# EAGLE design flossjtag (EAGLE 7.4.0)
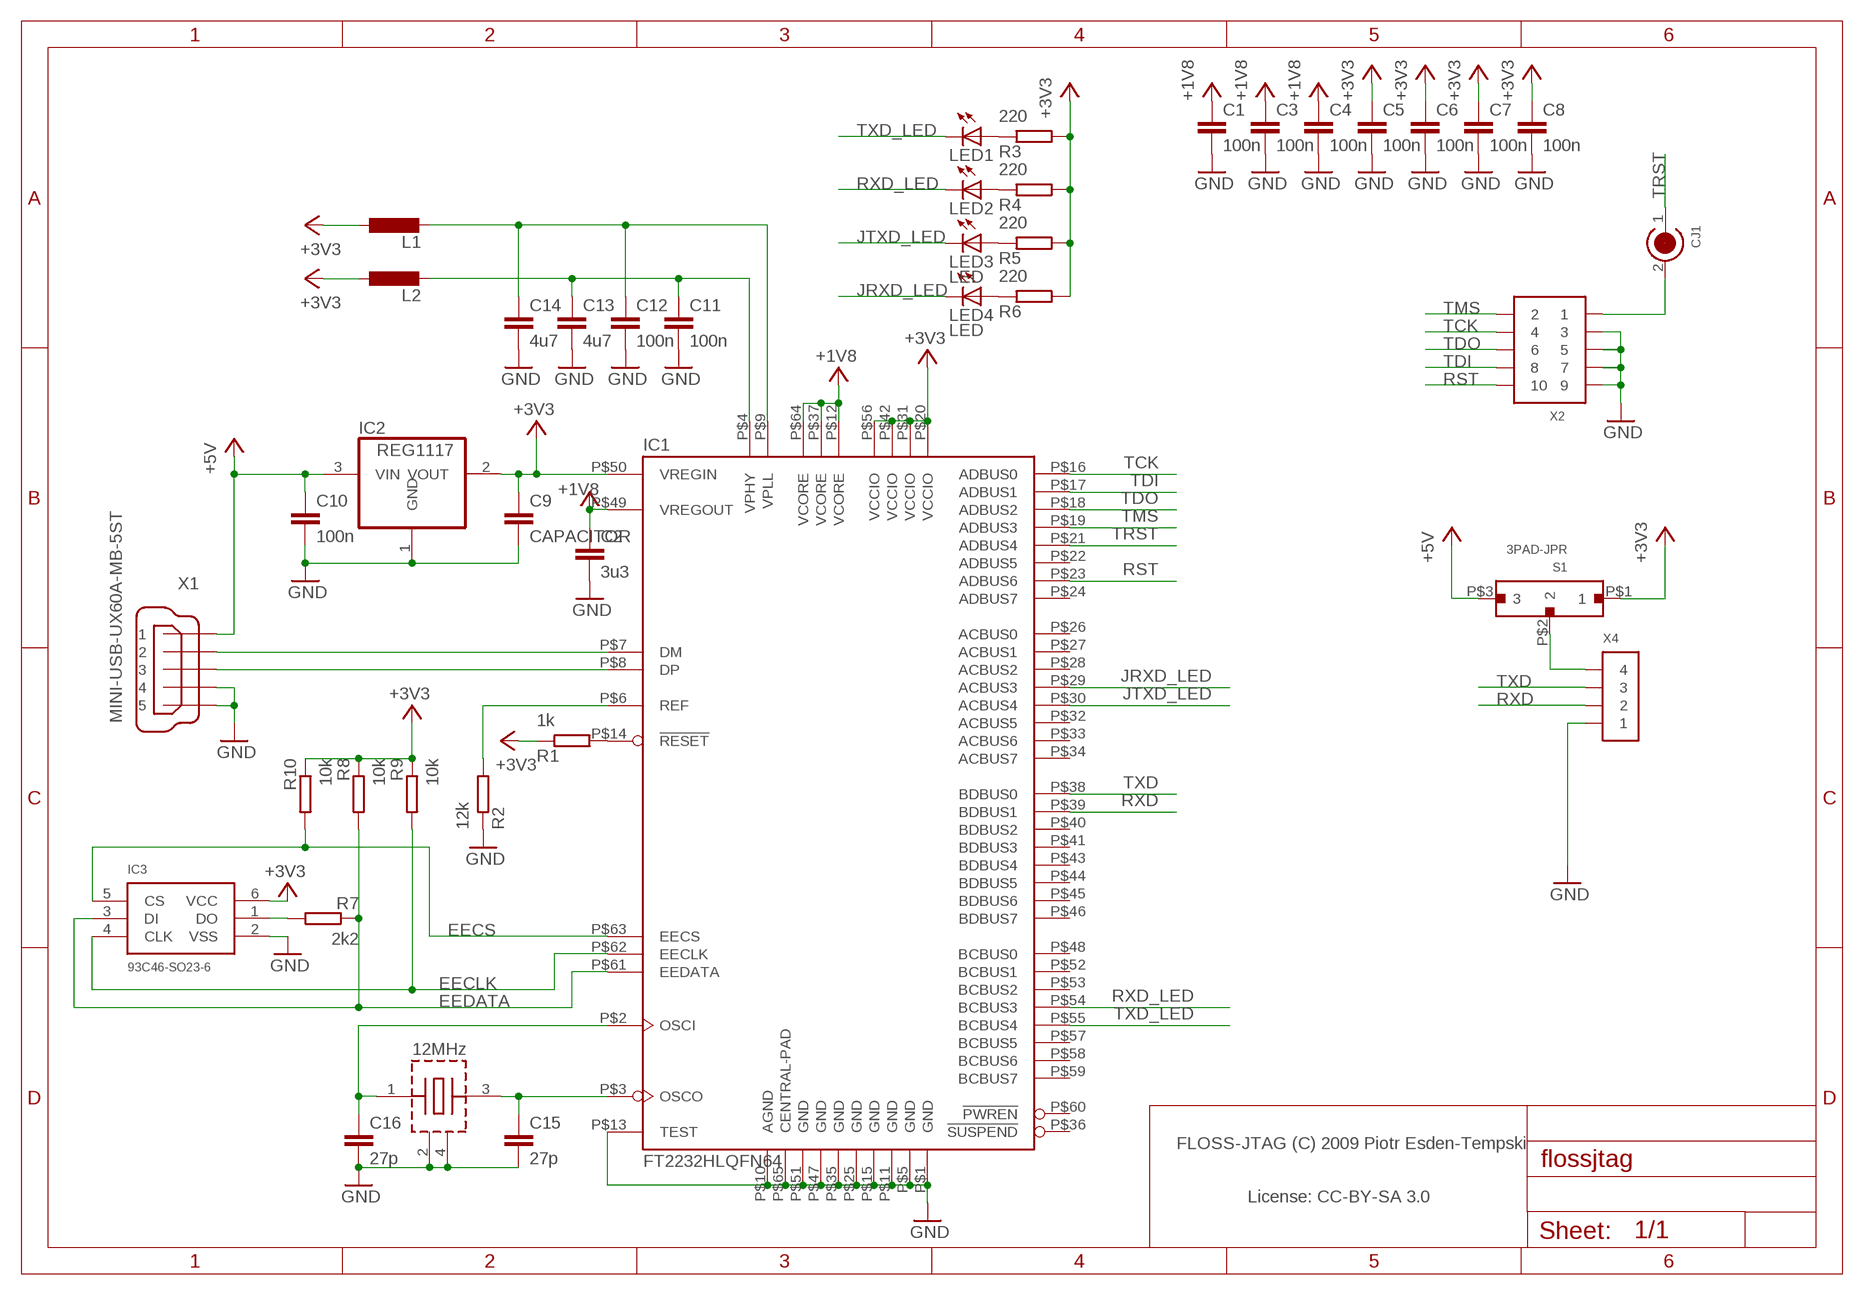
[diagram p0: schematic, sheet 1]

## Parts
C1  100n  CAPACITOR-0603  [0603-CAP]
C2  3u3  CAPACITOR-0603  [0603-CAP]
C3  100n  CAPACITOR-0603  [0603-CAP]
C4  100n  CAPACITOR-0603  [0603-CAP]
C5  100n  CAPACITOR-0603  [0603-CAP]
C6  100n  CAPACITOR-0603  [0603-CAP]
C7  100n  CAPACITOR-0603  [0603-CAP]
C8  100n  CAPACITOR-0603  [0603-CAP]
C9  CAPACITOR  [0603-CAP]
C10  100n  CAPACITOR  [0603-CAP]
C11  100n  CAPACITOR-0603  [0603-CAP]
C12  100n  CAPACITOR-0603  [0603-CAP]
C13  4u7  CAPACITOR-0603  [0603-CAP]
C14  4u7  CAPACITOR-0603  [0603-CAP]
C15  27p  CAPACITOR  [0603-CAP]
C16  27p  CAPACITOR  [0603-CAP]
CJ1  CIRC_JMP  [CIRC_JMP]
IC1  FT2232HLQFN64  [QFN64]
IC2  REG1117  [SOT223]
IC3  93C46-SO23-6  [SO23-6]
L1  INDUCTOR-0603  [0603-IND]
L2  INDUCTOR-0603  [0603-IND]
LED1  LED  [0603-LED]
LED2  LED  [0603-LED]
LED3  LED  [0603-LED]
LED4  LED  [0603-LED]
R1  1k  RESISTOR-0603  [0603-RES]
R2  12k  RESISTOR-0603  [0603-RES]
R3  220  RESISTOR-0603  [0603-RES]
R4  220  RESISTOR-0603  [0603-RES]
R5  220  RESISTOR-0603  [0603-RES]
R6  220  RESISTOR-0603  [0603-RES]
R7  2k2  RESISTOR-0603  [0603-RES]
R8  10k  RESISTOR-0603  [0603-RES]
R9  10k  RESISTOR-0603  [0603-RES]
R10  10k  RESISTOR-0603  [0603-RES]
S1  3PAD-JPR  [SW-JS102000SAQN]
X1  MINI-USB-UX60A-MB-5ST  [UX60A-MB-5ST]
X2  CONN_5-2-FTSH-V  [FTSH-105-DV]
X3  12MHz  NX3225SA  [NX3225SA]
X4  CONN_4-1  [PB-53261-04]

## Nets
+3V3: C5.P$1 C6.P$1 C7.P$1 C8.P$1 C9.P$1 IC1.P$20(VCCIO) IC1.P$31(VCCIO) IC1.P$42(VCCIO) IC1.P$50(VREGIN) IC1.P$56(VCCIO) IC2.2(VOUT) IC3.6(VCC) L1.P$1 L2.P$1 R1.P$1 R3.P$2 R4.P$2 R5.P$2 R6.P$2 R8.P$1 R9.P$1 R10.P$1 S1.P$1
+5V: C10.P$1 IC2.3(VIN) S1.P$3 X1.1
EECLK: IC1.P$62(EECLK) IC3.4(CLK) R9.P$2
EECS: IC1.P$63(EECS) IC3.5(CS) R10.P$2
EEDATA: IC1.P$61(EEDATA) IC3.3(DI) R7.P$1 R8.P$2
GND: C1.P$2 C2.P$2 C3.P$2 C4.P$2 C5.P$2 C6.P$2 C7.P$2 C8.P$2 C9.P$2 C10.P$2 C11.P$2 C12.P$2 C13.P$2 C14.P$2 C15.P$2 C16.P$2 IC1.P$1(GND) IC1.P$5(GND) IC1.P$10(AGND) IC1.P$11(GND) IC1.P$13(TEST) IC1.P$15(GND) IC1.P$25(GND) IC1.P$35(GND) IC1.P$47(GND) IC1.P$51(GND) IC1.P$65(CENTRAL-PAD) IC2.1(GND) IC3.2(VSS) R2.P$1 X1.4 X1.5 X2.3 X2.5 X2.7 X2.9 X3.2(GND) X3.4(GND) X4.1
JRXD_LED: IC1.P$29(ACBUS3) LED4.C
JTXD_LED: IC1.P$30(ACBUS4) LED3.C
N$1: IC1.P$14(!RESET) R1.P$2
N$2: IC1.P$6(REF) R2.P$2
N$3: IC1.P$7(DM) X1.2
N$4: IC1.P$8(DP) X1.3
N$6: C16.P$1 IC1.P$2(OSCI) X3.1(XTAL)
N$7: C12.P$1 C14.P$1 IC1.P$9(VPLL) L1.P$2
N$8: C11.P$1 C13.P$1 IC1.P$4(VPHY) L2.P$2
N$9: C15.P$1 IC1.P$3(OSCO) X3.3(XTAL)
N$10: LED1.A R3.P$1
N$11: LED2.A R4.P$1
N$12: LED3.A R5.P$1
N$13: LED4.A R6.P$1
N$14: S1.P$2 X4.4
N$17: IC3.1(DO) R7.P$2
N$19: CJ1.2 X2.1
RST: IC1.P$23(ADBUS6) X2.10
RXD: IC1.P$39(BDBUS1) X4.2
RXD_LED: IC1.P$54(BCBUS3) LED2.C
TCK: IC1.P$16(ADBUS0) X2.4
TDI: IC1.P$17(ADBUS1) X2.8
TDO: IC1.P$18(ADBUS2) X2.6
TMS: IC1.P$19(ADBUS3) X2.2
TRST: CJ1.1 IC1.P$21(ADBUS4)
TXD: IC1.P$38(BDBUS0) X4.3
TXD_LED: IC1.P$55(BCBUS4) LED1.C
VCC: C1.P$1 C2.P$1 C3.P$1 C4.P$1 IC1.P$12(VCORE) IC1.P$37(VCORE) IC1.P$49(VREGOUT) IC1.P$64(VCORE) ; supply symbol labelled +1V8
Unconnected: IC1.P$22(ADBUS5) IC1.P$24(ADBUS7) IC1.P$26(ACBUS0) IC1.P$27(ACBUS1) IC1.P$28(ACBUS2) IC1.P$32(ACBUS5) IC1.P$33(ACBUS6) IC1.P$34(ACBUS7) IC1.P$36(!SUSPEND) IC1.P$40(BDBUS2) IC1.P$41(BDBUS3) IC1.P$43(BDBUS4) IC1.P$44(BDBUS5) IC1.P$45(BDBUS6) IC1.P$46(BDBUS7) IC1.P$48(BCBUS0) IC1.P$52(BCBUS1) IC1.P$53(BCBUS2) IC1.P$57(BCBUS5) IC1.P$58(BCBUS6) IC1.P$59(BCBUS7) IC1.P$60(!PWREN)

## Notes on the sheet
- FLOSS-JTAG (C) 2009 Piotr Esden-Tempski
- License: CC-BY-SA 3.0

## Library data of the parts
C1-C8 C11-C14 = res_cap:CAPACITOR
C9 C10 C15 C16 = open-bldc:CAPACITOR
CJ1 = fancy_jumpers:CIRC_JMP
IC1 = ftdi-jtag:FT2232HL
IC2 = burr-brown:REG1117: 800mA and 1A Low Dropout (LDO) Positive Regulator 1.8V, 2.5V, 2.85V, 3.3V, 5V, and Adj
IC3 = misc:93C46: Microchip: 93AA46A/B/C, 93LC46A/B/C, 93C46A/B/C
L1 L2 = res_cap:INDUCTOR
LED1-LED4 = open-bldc:LED
R1-R10 = res_cap:RESISTOR
S1 = ftdi-jtag:3PAD-JPR
X1 = con-hirose:MINI-USB-: MINI USB Connector Source: http://www.hirose.co.jp/cataloge_hp/e24000019.pdf
X2 = pel_misc:CONN_5-2
X3 = misc:NX3225SA
X4 = open-bldc:CONN_4-1

## Board
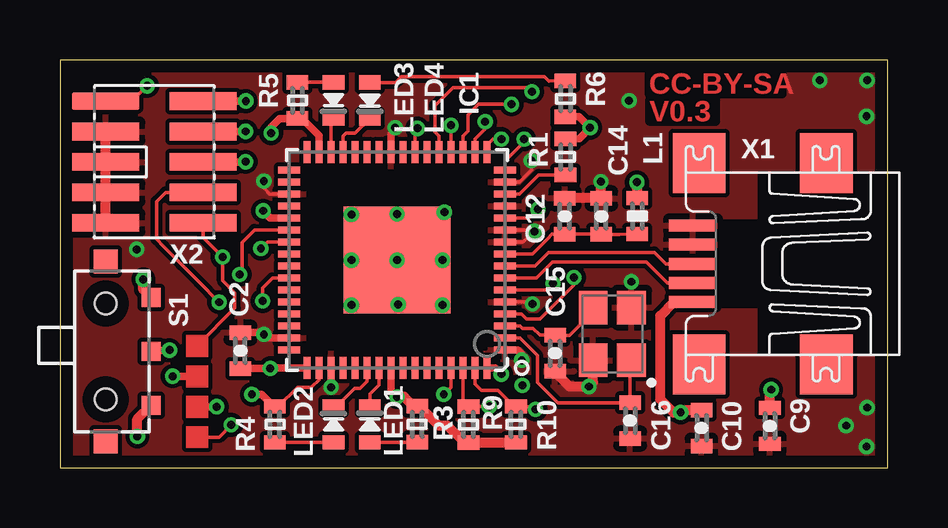
[diagram p1: board, top side]
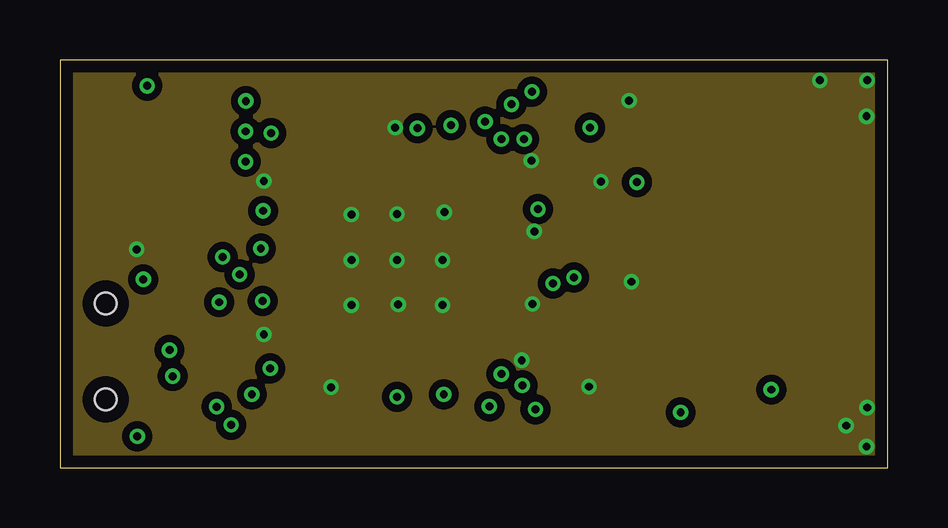
[diagram p2: board, inner layer Route2]
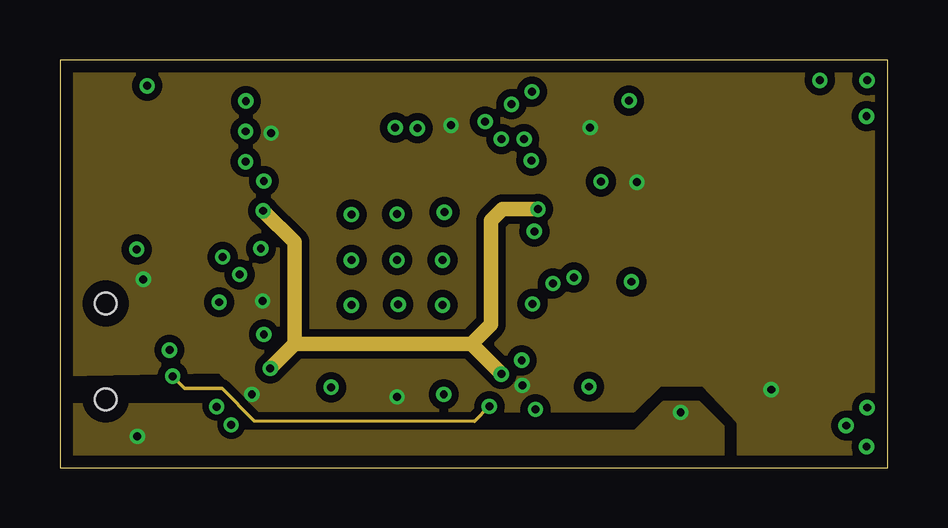
[diagram p3: board, inner layer Route15]
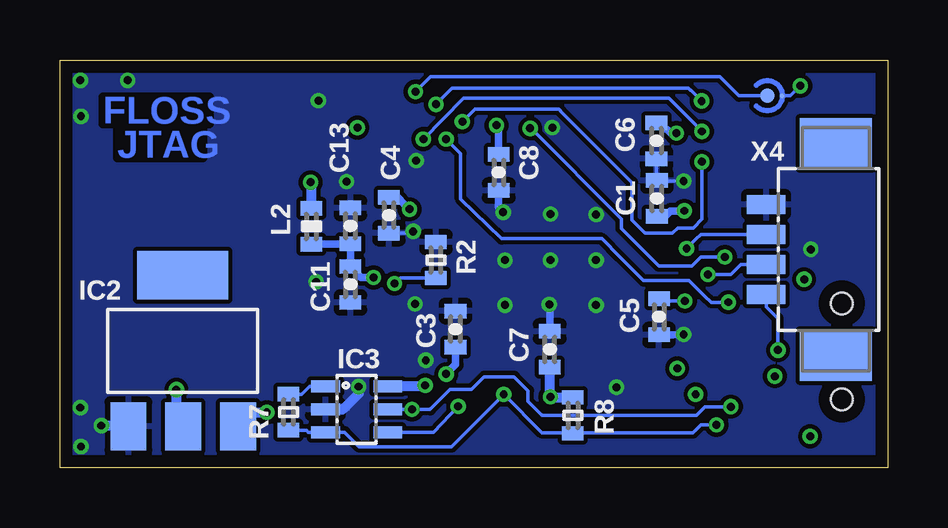
[diagram p4: board, bottom side, seen from below]

Size 34.5 x 17 mm. Coordinates in mm from the lower left corner, seen from the top.
Outline: 0,0 34.5,0 34.5,17 0,17 0,0
Copper layers (1*2+15*16): Top 0.035mm / dielectric 0.3mm / Route2 0.035mm / dielectric 0.15mm / Route15 0.035mm / dielectric 0.3mm / Bottom 0.035mm
Design rules "default *": minimum track width 6mil, minimum drill 12mil, track to track 7mil, track to pad 7mil, pad to pad 7mil, via to via 7mil, smd to smd 6mil, copper to edge 20mil, drill to drill 8mil, minimum pad ring 0.1mm, minimum via ring 6mil, stop-mask expansion 4mil, vias tented up to drill 0.4mm, thermal gap 10mil

### Footprints (pad centres in the part's own frame; a part is rotated, then mirrored left to right if it is on the bottom)
0603-CAP = smd 0.6 x 0.9: P$1 -0.75,0; P$2 0.75,0
CIRC_JMP = smd 0.61 x 0.61: 1 0,0 | smd 0.203 x 0.203: 2 0,0.617
QFN64 = smd 0.9 x 0.3: P$1 -4.5,3.75; P$2 -4.5,3.25; P$3 -4.5,2.75; P$4 -4.5,2.25; P$5 -4.5,1.75; P$6 -4.5,1.25; P$7 -4.5,0.75; P$8 -4.5,0.25; P$9 -4.5,-0.25; P$10 -4.5,-0.75; P$11 -4.5,-1.25; P$12 -4.5,-1.75; P$13 -4.5,-2.25; P$14 -4.5,-2.75; P$15 -4.5,-3.25; P$16 -4.5,-3.75; P$33 4.5,-3.75; P$34 4.5,-3.25; P$35 4.5,-2.75; P$36 4.5,-2.25; P$37 4.5,-1.75; P$38 4.5,-1.25; P$39 4.5,-0.75; P$40 4.5,-0.25; P$41 4.5,0.25; P$42 4.5,0.75; P$43 4.5,1.25; P$44 4.5,1.75; P$45 4.5,2.25; P$46 4.5,2.75; P$47 4.5,3.25; P$48 4.5,3.75 | smd 0.3 x 0.9: P$17 -3.75,-4.5; P$18 -3.25,-4.5; P$19 -2.75,-4.5; P$20 -2.25,-4.5; P$21 -1.75,-4.5; P$22 -1.25,-4.5; P$23 -0.75,-4.5; P$24 -0.25,-4.5; P$25 0.25,-4.5; P$26 0.75,-4.5; P$27 1.25,-4.5; P$28 1.75,-4.5; P$29 2.25,-4.5; P$30 2.75,-4.5; P$31 3.25,-4.5; P$32 3.75,-4.5; P$49 3.75,4.5; P$50 3.25,4.5; P$51 2.75,4.5; P$52 2.25,4.5; P$53 1.75,4.5; P$54 1.25,4.5; P$55 0.75,4.5; P$56 0.25,4.5; P$57 -0.25,4.5; P$58 -0.75,4.5; P$59 -1.25,4.5; P$60 -1.75,4.5; P$61 -2.25,4.5; P$62 -2.75,4.5; P$63 -3.25,4.5; P$64 -3.75,4.5 | smd 4.45 x 4.45: P$65 0,0
SOT223 = smd 1.499 x 2.007: 1 -2.261,-3.15; 2 0.025,-3.15; 3 2.311,-3.15 | smd 3.81 x 2.007: 4 0,3.15
SO23-6 = smd 0.5 x 1.2: 1 -0.95,-1.3; 2 0,-1.3; 3 0.95,-1.3; 4 0.95,1.3; 5 0,1.3; 6 -0.95,1.3
0603-IND = smd 0.6 x 0.9: P$1 -0.75,0; P$2 0.75,0
0603-LED = smd 0.6 x 0.9: A 0.75,0; C -0.75,0
0603-RES = smd 0.6 x 0.9: P$1 -0.75,0; P$2 0.75,0
SW-JS102000SAQN = smd 1 x 1: MNT1 -3.75,-1.9; MNT2 3.75,-1.9 | smd 0.8 x 0.8: P$1 -2.25,0; P$2 0,0; P$3 2.25,0 | hole 0.9: -2,-1.9; 2,-1.9
UX60A-MB-5ST = smd 2 x 0.5: 1 2.25,1.6; 2 2.25,0.8; 3 2.25,0; 4 2.25,-0.8; 5 2.25,-1.6 | smd 2.2 x 2.5: M1 -3.3,-4.2; M2 -3.3,4.2; M3 2,4.2; M4 2,-4.2
FTSH-105-DV = smd 0.74 x 2.8: 1 -2.54,-2.03; 2 -2.54,2.03; 3 -1.27,-2.03; 4 -1.27,2.03; 5 0,-2.03; 6 0,2.03; 7 1.27,-2.03; 8 1.27,2.03; 9 2.54,-2.03; 10 2.54,2.03
NX3225SA = smd 1.4 x 1.2: 1 -1.1,-0.8; 2 1.1,-0.8; 3 1.1,0.8; 4 -1.1,0.8
PB-53261-04 = smd 0.8 x 1.6: 1 1.875,1.1; 2 0.625,1.1; 3 -0.625,1.1; 4 -1.875,1.1 | smd 2.1 x 3: MNT1 -4.425,-1.8; MNT2 4.425,-1.8

### Placement (x,y rotation side)
C1  9.61,11.22 90 bottom
C2  7.52,4.88 90 top
C3  18.01,5.77 90 bottom
C4  20.79,10.53 270 bottom
C5  9.53,6.29 270 bottom
C6  9.63,13.63 270 bottom
C7  14.08,4.93 90 bottom
C8  16.21,12.31 270 bottom
C9  29.59,1.74 270 top
C10  26.75,1.65 270 top
C11  22.39,7.64 270 bottom
C12  21.04,10.48 90 top
C13  22.39,10.08 90 bottom
C14  22.57,10.48 90 top
C15  20.64,4.76 270 top
C16  23.77,1.96 270 top
CJ1  5,15.51 270 bottom
DRILEGEND  [DRILEGEND]  -2.76,-5.53 0 top  (outside the outline)
IC1  14.05,8.65 180 top
IC2  29.39,4.87 0 bottom
IC3  22.13,2.43 270 bottom
L1  24.07,10.49 270 top
L2  24.02,10.06 270 bottom
LED1  12.92,1.8 270 top
LED2  11.4,1.8 270 top
LED3  11.4,15.32 90 top
LED4  12.92,15.31 90 top
R1  21.07,12.95 270 top
R2  18.83,8.66 270 bottom
R3  14.89,1.8 90 top
R4  8.96,1.8 90 top
R5  9.9,15.31 270 top
R6  21.07,15.38 270 top
R7  24.97,2.32 90 bottom
R8  13.12,2.18 270 bottom
R9  17.03,1.79 90 top
R10  19.01,1.8 90 top
S1  3.8,4.85 270 top
X1  28.64,8.5 180 top
X2  3.94,12.75 270 top
X3  23.03,5.57 90 top
X4  3.96,9.1 90 bottom

### Tracks (layer width: path | path; a pad name or v marks a point on that pad's centre or on a via)
+3V3  (via drill 0.33 pad 0.64)
  Top 0.152: 8.9,2.55 R4.P$2 9.1,2.55 9.9,3.35 10.5,3.35 10.5,3.36 10.79,3.66 IC1.P$50 | R3.P$2 14.75,2.55 | R3.P$2 15.05,2.55 | 10.19,14.46 R5.P$2 9.88,14.55 | 17.04,1.05 R9.P$1 16.86,1.04 | 15,2.55 R3.P$2 | IC1.P$42 8.86,7.91 8.45,7.5 v8.45,6.95 | IC1.P$20 16.3,14.17 v16.3,14.28
  Top 0.305: 8.9,2.55 8.4,3.05 v8,3.05 | IC1.P$56 13.8,3.2 v14.05,2.95 | IC1.P$31 10.8,13.85 10.19,14.46 | R1.P$1 21.65,13.72 v22.1,14.18 21.63,14.63 R6.P$2 | 9.88,14.55 9.15,14.55 8.8,14.2 v8.8,13.95
  Top 0.406: C9.P$1 29.59,3.16 v29.65,3.25 | 14.75,2.55 14.35,2.95 v14.05,2.95 | 17.04,1.05 R10.P$1 | 16.86,1.04 16.15,1.75 15.8,1.75 15,2.55 | S1.P$1 3.48,7.42 v3.48,7.85 | L1.P$1 24.04,11.66 v24.05,11.9
  Bottom 0.152: 14.03,2.93 v14.05,2.95 14.08,2.98 | v8.45,6.95 9.39,6.95 C5.P$1 | v16.3,14.28 16.23,14.2
  Bottom 0.203: 29.65,2.01 IC2.2
  Bottom 0.305: C8.P$1 16.21,14.19 v16.3,14.28 | v8.8,13.95 9.03,13.95 9.15,14.07 C6.P$1
  Bottom 0.406: v29.65,3.25 29.65,2.01 | 14.03,2.93 R8.P$1 | 14.08,2.98 C7.P$1 | L2.P$1 24.02,11.87 v24.05,11.9 | IC3.6 19.35,3.38 v19.27,3.42
  pour Route15 (isolate 0.305): 0,3.9 6.67,4.04 8.1,2.4 23.9,2.4 25,3.5 26.8,3.5 28.3,1.9 28.3,0 34.5,0 34.5,17 0,17
+5V  (via drill 0.33 pad 0.64)
  Top 0.406: v3.23,1.3 3.23,2.02 S1.P$3 | X1.1 25.6,6.9 25.02,6.33 25.02,2.85 25.57,2.3 v25.88,2.3 25.97,2.4 C10.P$1
  Bottom 0.203: IC2.3 27.07,1.88 26.65,2.3
  Bottom 0.406: 26.65,2.3 v25.88,2.3
  pour Route15 (isolate 0.254): 0,0 0,2.6 6.6,2.6 7.5,1.5 24,1.5 25.2,2.7 26.6,2.7 27.6,1.7 27.6,0
EECLK  (via drill 0.33 pad 0.64)
  Top 0.152: IC1.P$62 16.8,2.76 R9.P$2 v17.89,2.54 v17.9,2.55
  Top 0.305: v4.7,3.81 5.71,3.81
  Route15 0.152: v17.9,2.55 v17.89,2.55 17.27,1.93 8.1,1.96 6.76,3.31 6.21,3.31 5.19,3.31 v4.7,3.81
  Bottom 0.152: IC3.4 18.92,1.48 v17.9,2.55
EECS  (via drill 0.33 pad 0.64)
  Top 0.152: IC1.P$63 17.3,3.5 17.58,3.22 18.25,3.22 18.92,2.55 R10.P$2 19.04,2.52 19.73,2.52 v19.82,2.42
  Top 0.305: v6.53,2.54 5.71,2.54
  Bottom 0.152: IC3.5 20.07,2.43 v19.82,2.42 19.06,2.42 18.24,3.25 17.35,3.25 16.82,3.79 15.57,3.79 14.99,3.2 14.99,2.77 14.4,2.18 7.98,2.18 7.62,2.54 v6.53,2.54
EEDATA  (via drill 0.33 pad 0.64)
  Top 0.152: IC1.P$61 16.3,3.35 v16,3.05 | v7.14,1.78 6.63,1.27 5.71,1.27
  Bottom 0.152: 13.14,1.45 14.4,1.45 v16,3.05 18.18,0.88 22.02,0.88 22.63,1.48 IC3.3 24.15,1.48 24.23,1.55 24.96,1.55 R7.P$1 | 13.14,1.45 R8.P$2 | 8.11,1.45 | 8.11,1.45 13.14,1.45 | v7.14,1.78 7.78,1.78 8.11,1.45
GND  (via drill 0.33 pad 0.64)
  Top 0.152: IC1.P$35 8.74,11.4 8.5,11.65 v8.5,11.95 | IC1.P$47 | 13.8,13.9 v13.97,14.18 | IC1.P$10 19.3,9.4 v19.77,9.85 19.57,9.9 IC1.P$11 | IC1.P$65 14.05,6.85 v14.1,6.8 | IC1.P$15 19.16,11.9 19.65,12.4 v19.65,12.8 | C14.P$2 22.54,11.23 | IC1.P$5 19.62,6.91 v19.7,6.83
  Top 0.305: IC1.P$47 8.65,5.4 v8.5,5.55 8.42,5.63 C2.P$2 | IC1.P$25 13.8,13.9 | IC1.P$51 11.3,3.55 v11.3,3.35 | IC1.P$1 19.07,4.91 19.25,4.72 v19.25,4.47 | 20.64,3.98 C15.P$2
  Top 0.406: X2.3 X2.5 X2.7 X2.9 2.69,10.21 | 22.54,11.23 C12.P$2 | C14.P$2 22.54,11.94 v22.55,11.93 | 20.64,3.98 21.25,3.38 v22.05,3.38 22.23,3.55 X3.4
  Bottom 0.152: v8.5,11.95 9.59,11.95 C1.P$2 9.63,11.99 C6.P$2 | 14.08,6.78 v14.1,6.8 | C4.P$2 19.7,9.78 v19.77,9.85 | R2.P$1 19.05,9.41
  Bottom 0.203: IC2.1 31.67,1.75
  Bottom 0.305: C7.P$2 14.08,6.78 | C5.P$2 8.94,5.54 v8.5,5.55 | C8.P$2 16.21,10.84 v16.02,10.65
  Bottom 0.406: 31.67,1.75 v32.77,1.75 | v22.05,3.38 22.05,3.08 22.55,2.58 22.73,2.42 IC3.2
  other vias: 33.62,0.88 33.65,2.5 23.73,15.3 33.65,16.15 31.68,16.15 33.62,14.65 3.2,9.1 23.82,7.75 12.15,6.78 15.95,6.78 15.95,8.65 14.05,10.57 14.05,8.65 12.15,8.65 12.15,10.55
  pour Route2 (isolate 0.305): 0,0 34.5,0 34.5,17 0,17
  pour Top: 0,0 34.5,0 34.5,17 0,17
  pour Bottom: 0,0 34.5,0 34.5,17 0,17
JRXD_LED
  Top 0.152: IC1.P$29 11.8,13.82 11.92,13.94 12.31,13.94 LED4.C
JTXD_LED
  Top 0.152: IC1.P$30 11.3,14.37 LED3.C
N$1
  Top 0.152: IC1.P$14 19.16,11.4 19.95,12.2 20.52,12.2 R1.P$2
N$2  (via drill 0.33 pad 0.64)
  Top 0.152: IC1.P$6 20.32,7.41 v20.55,7.67
  Bottom 0.152: v20.55,7.67 20.3,7.9 18.99,7.9 R2.P$2
N$3
  Top 0.152: X1.2 25.32,7.7 24.45,8.57 20.53,8.57 19.86,7.91 IC1.P$7
N$4
  Top 0.152: X1.3 25.25,8.5 24.77,8.97 20.37,8.97 19.8,8.41 IC1.P$8
N$6
  Top 0.152: IC1.P$2 19.17,5.41 19.9,4.67 19.9,3.55 20.75,2.7 C16.P$1 23.77,4.41 X3.1
N$7
  Top 0.152: IC1.P$9 19.69,8.9 20.32,9.53 20.52,9.73 C12.P$1 22.22,9.73 C14.P$1 23.33,9.73 L1.P$2
N$8  (via drill 0.33 pad 0.64)
  Top 0.152: IC1.P$4 19.25,6.41 19.45,6.2 20,6.2 21.43,7.62 v21.43,7.92
  Bottom 0.305: C13.P$1 C11.P$1 22.39,8.37 21.95,7.92 v21.43,7.92 | C13.P$1 | C13.P$1 24,9.33 L2.P$2
N$9
  Top 0.152: IC1.P$3 19.17,5.91 19.27,5.8 19.73,5.8 20,5.53 20.63,5.53 C15.P$1 21.24,5.51 22.23,6.5 X3.3
N$10
  Top 0.152: LED1.A R3.P$1
N$11
  Top 0.152: LED2.A 10.11,1.05 R4.P$1
N$12
  Top 0.152: LED3.A 10.67,16.07 R5.P$1
N$13
  Top 0.152: LED4.A 13.99,16.06 14.09,16.16 14.22,16.3 20.2,16.3 20.38,16.12 R6.P$1
N$14  (via drill 0.33 pad 0.64)
  Top 0.152: S1.P$2 3.83,4.88
  Top 0.305: v4.57,4.9 4.48,4.88 3.83,4.88
  Bottom 0.152: v4.57,4.9 4.57,6.21 4.57,6.22 5.05,6.7 X4.4
N$17
  Bottom 0.152: IC3.1 24.1,3.38 24.43,3.05 24.96,3.05 R7.P$2
N$19  (via drill 0.33 pad 0.64)
  Top 0.152: X2.1 2.99,15.29 3.33,15.61 v3.64,15.92
  Bottom 0.152: CJ1.2 4.05,15.51 v3.64,15.92
RST  (via drill 0.33 pad 0.64)
  Top 0.152: X2.10 5.96,9.6 v6.78,8.78 6.78,7.8 7.29,7.29 7.29,6.66 5.71,5.08 | v14.9,14.15 14.8,14 IC1.P$23
  Bottom 0.152: v6.78,8.78 7.78,8.78 8.15,8.41 8.68,8.41 8.82,8.41 9.53,8.41 11.1,9.97 11.1,10.38 14.88,14.15 v14.9,14.15
RXD  (via drill 0.33 pad 0.64)
  Top 0.152: v8.38,9.14 8.43,9.19 8.65,9.41 IC1.P$39
  Bottom 0.152: X4.2 6.53,9.72 7.78,9.72 7.99,9.53 v8.38,9.14
RXD_LED
  Top 0.152: IC1.P$54 12.8,3.6 12.5,3.3 12.28,3.3 11.53,2.56 11.5,2.56 LED2.C
TCK  (via drill 0.33 pad 0.64)
  Top 0.152: IC1.P$16 18.55,12.78 19.35,13.57 v19.35,13.7
  Top 0.305: X2.4 v7.73,14.02 v7.74,14.02
  Bottom 0.152: v7.74,14.02 v7.74,14.03 9.12,15.4 17.68,15.4 v19.35,13.7
TDI  (via drill 0.33 pad 0.64)
  Top 0.152: X2.8 4.4,11.48 4.02,11.1 4.03,9.53 4.3,9.24 5.07,8.47 5.4,8.14 5.78,7.76 v6.64,6.89 | IC1.P$17 17.8,13.45 18.05,13.7 v18.4,13.7
  Bottom 0.152: v6.64,6.89 7.35,6.89 7.63,7.15 8.28,7.8 10.18,7.8 11.16,8.79 11.92,9.54 16.09,9.54 17.8,11.2 17.8,13.1 v18.4,13.7
TDO  (via drill 0.33 pad 0.64)
  Top 0.152: v7.74,12.75 v7.73,12.75 | IC1.P$18 17.3,13.7 17.73,14.12 v17.73,14.43
  Top 0.305: v7.73,12.75 X2.6
  Bottom 0.152: v7.74,12.75 7.74,10.37 8.1,10 8.75,10 8.97,9.78 10.12,9.78 10.65,10.31 10.65,11.89 13.62,14.87 13.62,14.88 13.7,14.95 17.2,14.95 v17.73,14.43
TMS  (via drill 0.33 pad 0.64)
  Top 0.152: IC1.P$19 16.8,13.83 17,14.03 17,14.7 17.45,15.15 v18.82,15.15
  Top 0.305: X2.2 7.71,15.29 v7.75,15.29
  Bottom 0.152: v7.75,15.29 8.21,15.74 8.22,15.74 8.3,15.82 18.15,15.82 v18.82,15.15
TRST  (via drill 0.33 pad 0.64)
  Top 0.152: IC1.P$21 15.8,13.82 15.62,14 15.62,15.1 16.38,15.85 19.5,15.85 v19.68,15.68
  Bottom 0.152: CJ1.1 6.2,15.51 6.99,16.3 19.05,16.3 v19.68,15.68
TXD  (via drill 0.33 pad 0.64)
  Top 0.152: 7.56,8.14 v7.49,8.06 7.58,8.16 7.58,9.38 8.11,9.91 IC1.P$38
  Bottom 0.152: X4.3 6.12,8.47 6.54,8.06 v7.49,8.06
TXD_LED
  Top 0.152: IC1.P$55 13.3,3.45 12.92,3.07 LED1.C
VCC  (via drill 0.33 pad 0.64)
  Top 0.152: IC1.P$49 10.27,4.13 | IC1.P$12 19.55,10.4 v19.93,10.78
  Top 0.305: IC1.P$37 8.77,10.4 v8.47,10.71 | IC1.P$64 18.14,4.16 v18.4,3.9 | C2.P$1 v8.76,4.13 v8.77,4.13 8.79,4.16 IC1.P$49
  Route15 0.61: v8.77,4.13 v8.77,4.14 9.78,5.15 | 9.78,5.15 9.78,9.4 v8.47,10.71 | 9.78,5.15 17.15,5.15 | 17.15,5.15 v18.4,3.9 | v19.93,10.78 18.45,10.78 17.98,10.3 17.98,5.97 17.15,5.15
  Bottom 0.152: C1.P$1
  Bottom 0.305: v8.47,10.71 9.05,10.71 9.28,10.48 C1.P$1 | v18.4,3.9 18.01,4.3 C3.P$1 | C4.P$1 20.43,11.28 20.13,10.97 v19.93,10.78
(copper drawn outside any net)
  shapes: Top area x4

### Text on the board
Top: CC-BY-SA | V0.3
Bottom: FLOSS | JTAG
bStop: FLOSS | JTAG
_tNames: IC1 | R6 | R5 | LED3 | LED4 | R1 | L1 | X1 | C14 | X2 | C12 | C15 | S1 | C2 | LED2 | LED1 | C16 | C10 | C9 | R9 | R4 | R3 | R10
_bNames: C6 | X4 | C8 | C4 | C13 | C1 | L2 | R2 | C11 | C5 | IC2 | C3 | IC3 | C7 | R8 | R7